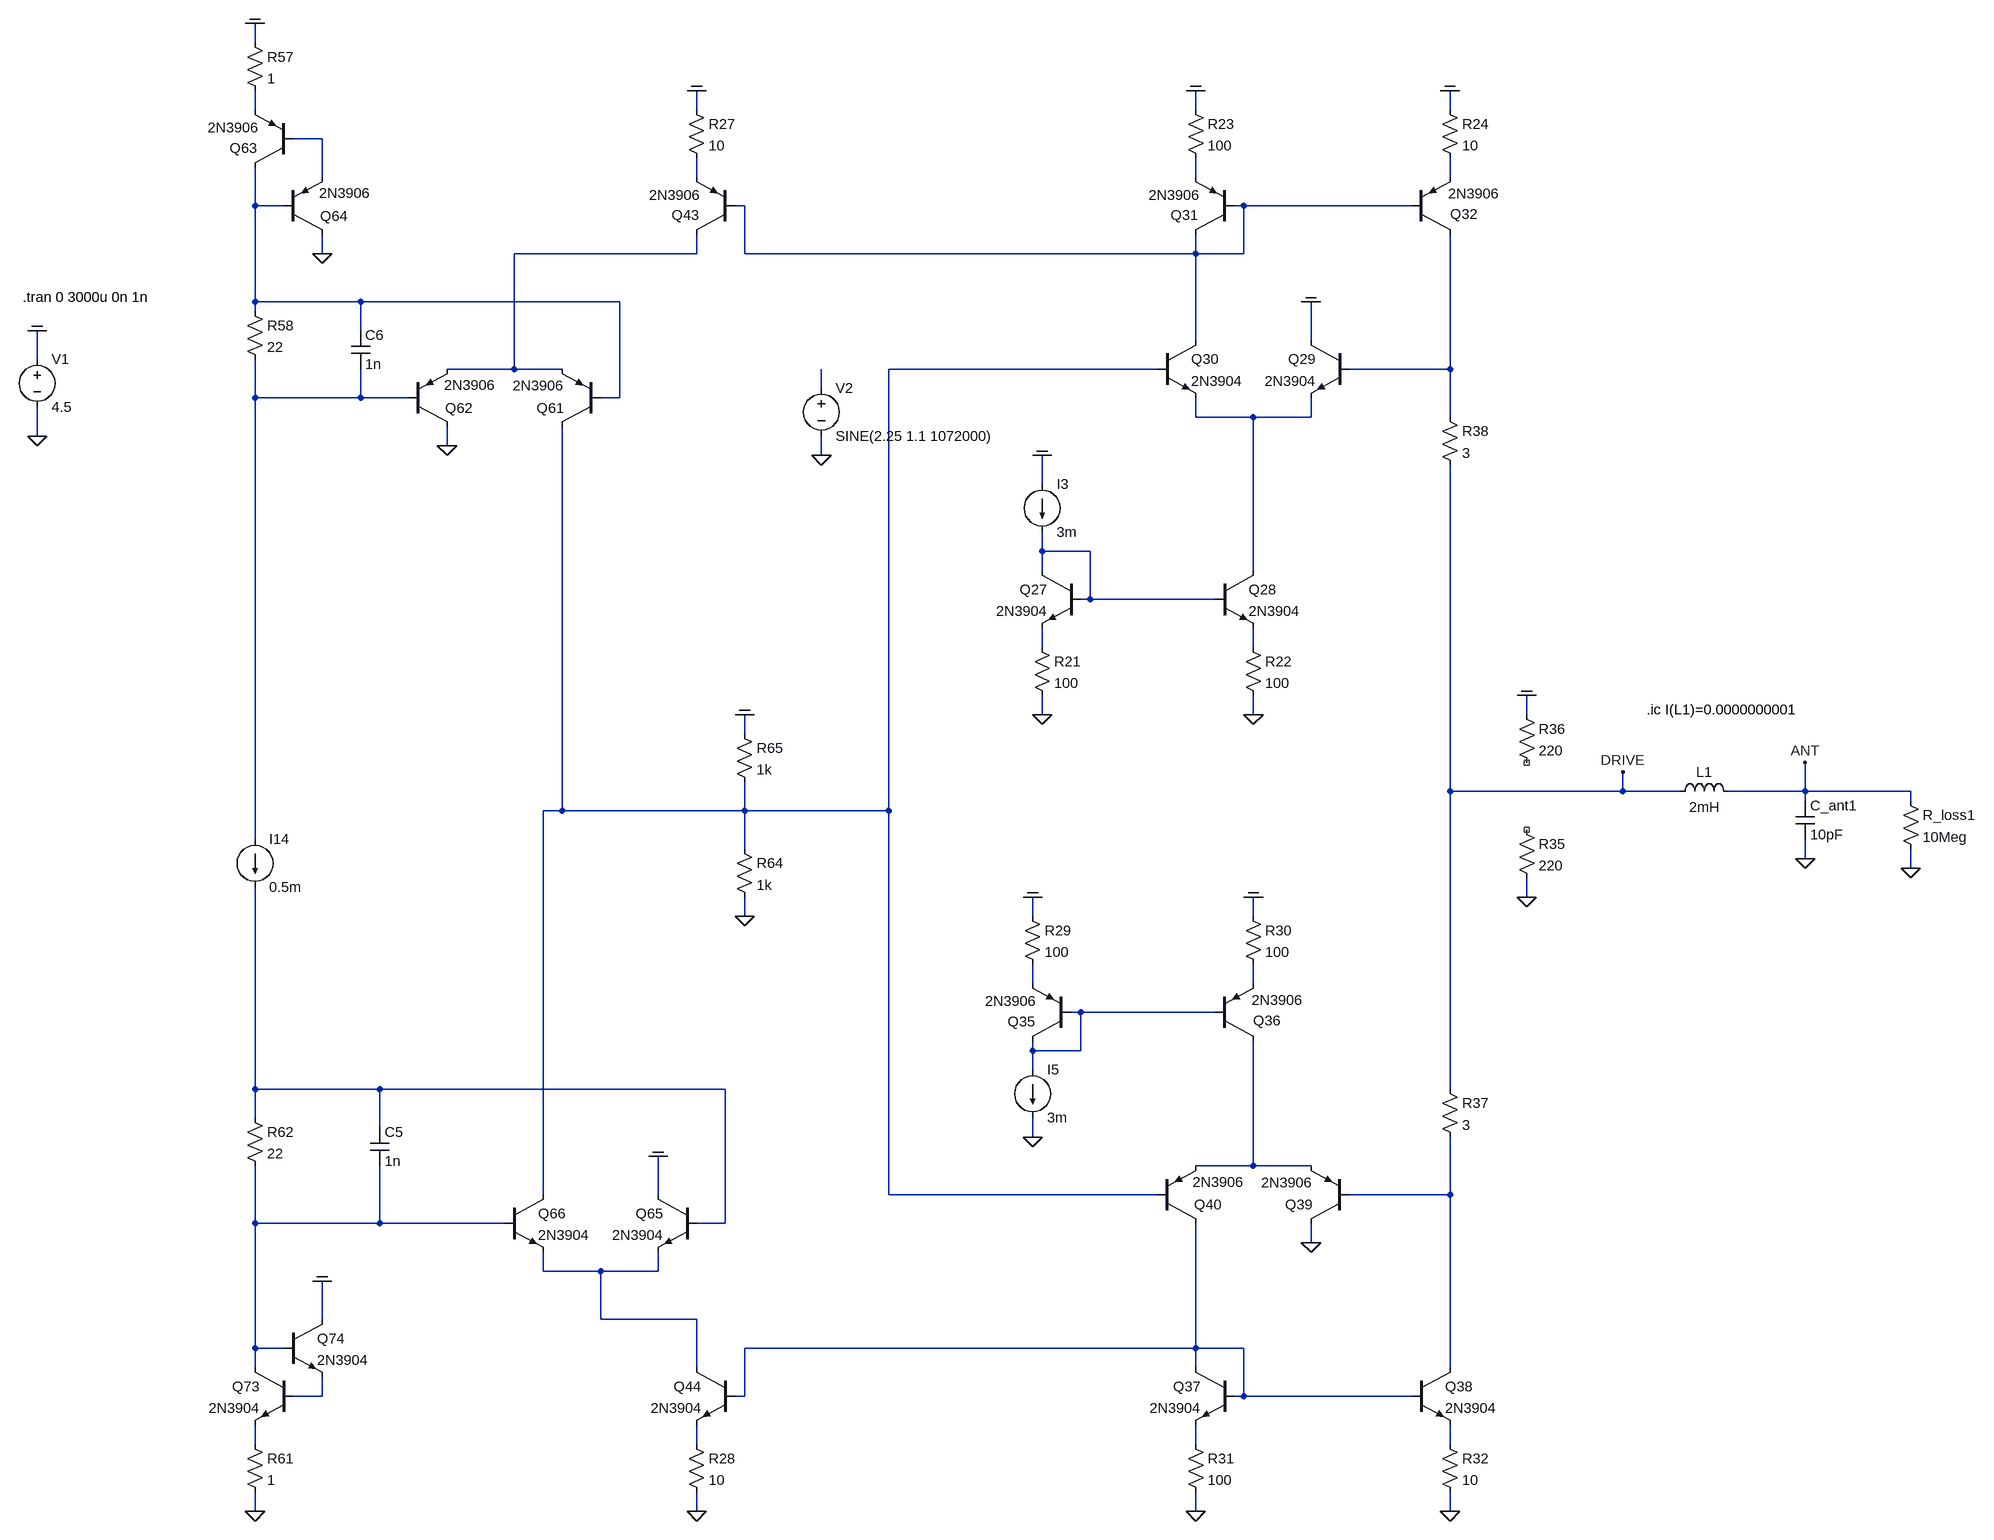
[diagram p0: schematic current_sensing_drive_buffer_v01.asc]
current_sensing_drive_buffer_v01.asc, the LTspice schematic file:
Version 4
SHEET 1 4504 6144
WIRE -320 1792 -320 1760
WIRE -320 1904 -320 1872
WIRE 416 1904 416 1872
WIRE 1248 1904 1248 1872
WIRE 1760 1904 1760 1872
WIRE -208 1952 -256 1952
WIRE -208 2016 -208 1952
WIRE 416 2016 416 1984
WIRE 1248 2016 1248 1984
WIRE 1760 2016 1760 1984
WIRE -320 2064 -320 2000
WIRE -272 2064 -320 2064
WIRE 496 2064 480 2064
WIRE 1328 2064 1312 2064
WIRE 1696 2064 1328 2064
WIRE -208 2144 -208 2112
WIRE 416 2144 416 2112
WIRE 416 2144 112 2144
WIRE 496 2144 496 2064
WIRE 1248 2144 1248 2112
WIRE 1248 2144 496 2144
WIRE 1328 2144 1328 2064
WIRE 1328 2144 1248 2144
WIRE -320 2224 -320 2064
WIRE -144 2224 -320 2224
WIRE 288 2224 -144 2224
WIRE -320 2240 -320 2224
WIRE -144 2272 -144 2224
WIRE 1248 2288 1248 2144
WIRE 1440 2288 1440 2224
WIRE -848 2320 -848 2272
WIRE 112 2336 112 2144
WIRE 112 2336 0 2336
WIRE 192 2336 112 2336
WIRE 1184 2336 736 2336
WIRE 1760 2336 1760 2112
WIRE 1760 2336 1504 2336
WIRE 624 2368 624 2336
WIRE -320 2384 -320 2320
WIRE -144 2384 -144 2336
WIRE -144 2384 -320 2384
WIRE -64 2384 -144 2384
WIRE 288 2384 288 2224
WIRE 288 2384 256 2384
WIRE 1248 2416 1248 2384
WIRE 1344 2416 1248 2416
WIRE 1440 2416 1440 2384
WIRE 1440 2416 1344 2416
WIRE 1760 2416 1760 2336
WIRE -848 2448 -848 2400
WIRE 0 2464 0 2432
WIRE 624 2480 624 2448
WIRE 992 2528 992 2480
WIRE 992 2640 992 2608
WIRE 1072 2640 992 2640
WIRE 992 2672 992 2640
WIRE 1344 2672 1344 2416
WIRE 1072 2720 1072 2640
WIRE 1072 2720 1056 2720
WIRE 1280 2720 1072 2720
WIRE 992 2800 992 2768
WIRE 1344 2800 1344 2768
WIRE 992 2912 992 2880
WIRE 1344 2912 1344 2880
WIRE 1888 2912 1888 2880
WIRE 496 2944 496 2912
WIRE 1760 3040 1760 2496
WIRE 2048 3040 2048 3008
WIRE 2048 3040 1760 3040
WIRE 2144 3040 2048 3040
WIRE 2352 3040 2352 2992
WIRE 2352 3040 2224 3040
WIRE 2528 3040 2352 3040
WIRE 2352 3056 2352 3040
WIRE 2528 3056 2528 3040
WIRE 192 3072 192 2432
WIRE 192 3072 160 3072
WIRE 496 3072 496 3024
WIRE 496 3072 192 3072
WIRE 736 3072 736 2336
WIRE 736 3072 496 3072
WIRE -320 3120 -320 2384
WIRE 496 3136 496 3072
WIRE 2352 3152 2352 3120
WIRE 2528 3168 2528 3136
WIRE 1888 3216 1888 3184
WIRE 496 3248 496 3216
WIRE 976 3248 976 3216
WIRE 1344 3248 1344 3216
WIRE 976 3360 976 3328
WIRE 1344 3360 1344 3328
WIRE 1056 3408 1040 3408
WIRE 1280 3408 1056 3408
WIRE 976 3472 976 3456
WIRE 1056 3472 1056 3408
WIRE 1056 3472 976 3472
WIRE 976 3504 976 3472
WIRE -320 3536 -320 3200
WIRE -112 3536 -320 3536
WIRE 464 3536 -112 3536
WIRE 1760 3536 1760 3040
WIRE -320 3584 -320 3536
WIRE -112 3600 -112 3536
WIRE 976 3616 976 3584
WIRE 1344 3664 1344 3456
WIRE 1344 3664 1248 3664
WIRE 1440 3664 1344 3664
WIRE 160 3712 160 3072
WIRE 352 3712 352 3648
WIRE 736 3712 736 3072
WIRE 1184 3712 736 3712
WIRE 1760 3712 1760 3616
WIRE 1760 3712 1504 3712
WIRE -320 3760 -320 3664
WIRE -112 3760 -112 3664
WIRE -112 3760 -320 3760
WIRE 96 3760 -112 3760
WIRE 464 3760 464 3536
WIRE 464 3760 416 3760
WIRE 1440 3792 1440 3760
WIRE 160 3840 160 3808
WIRE 256 3840 160 3840
WIRE 352 3840 352 3808
WIRE 352 3840 256 3840
WIRE -208 3920 -208 3856
WIRE 256 3920 256 3840
WIRE 416 3920 256 3920
WIRE -320 3968 -320 3760
WIRE -272 3968 -320 3968
WIRE 1248 3968 1248 3760
WIRE 1248 3968 496 3968
WIRE 1328 3968 1248 3968
WIRE -320 4000 -320 3968
WIRE 416 4000 416 3920
WIRE 1248 4000 1248 3968
WIRE 1760 4000 1760 3712
WIRE -208 4048 -208 4016
WIRE -208 4048 -256 4048
WIRE 496 4048 496 3968
WIRE 496 4048 480 4048
WIRE 1328 4048 1328 3968
WIRE 1328 4048 1312 4048
WIRE 1696 4048 1328 4048
WIRE -320 4128 -320 4096
WIRE 416 4128 416 4096
WIRE 1248 4128 1248 4096
WIRE 1760 4128 1760 4096
WIRE -320 4240 -320 4208
WIRE 416 4240 416 4208
WIRE 1248 4240 1248 4208
WIRE 1760 4240 1760 4208
FLAG -848 2448 0
FLAG -848 2272 COM
FLAG 992 2912 0
FLAG 1344 2912 0
FLAG 992 2480 COM
FLAG 1248 1872 COM
FLAG 1760 1872 COM
FLAG 1440 2224 COM
FLAG 624 2480 0
FLAG 976 3216 COM
FLAG 1344 3216 COM
FLAG 976 3616 0
FLAG 1248 4240 0
FLAG 1760 4240 0
FLAG 1440 3792 0
FLAG 416 1872 COM
FLAG 416 4240 0
FLAG 1888 3216 0
FLAG 1888 2880 COM
FLAG 2352 3152 0
FLAG 2352 2992 ANT
FLAG 2048 3008 DRIVE
FLAG 2528 3168 0
FLAG 496 3248 0
FLAG 496 2912 COM
FLAG -320 1760 COM
FLAG 0 2464 0
FLAG 352 3648 COM
FLAG -320 4240 0
FLAG -208 2144 0
FLAG -208 3856 COM
SYMBOL voltage -848 2304 R0
SYMATTR InstName V1
SYMATTR Value 4.5
SYMBOL npn 1056 2672 M0
SYMATTR InstName Q27
SYMATTR Value 2N3904
SYMBOL npn 1280 2672 R0
SYMATTR InstName Q28
SYMATTR Value 2N3904
SYMBOL Res 976 2784 R0
SYMATTR InstName R21
SYMATTR Value 100
SYMBOL Res 1328 2784 R0
SYMATTR InstName R22
SYMATTR Value 100
SYMBOL current 992 2528 R0
SYMATTR InstName I3
SYMATTR Value 3m
SYMBOL npn 1504 2288 M0
SYMATTR InstName Q29
SYMATTR Value 2N3904
SYMBOL npn 1184 2288 R0
SYMATTR InstName Q30
SYMATTR Value 2N3904
SYMBOL pnp 1312 2112 R180
WINDOW 0 60 32 Left 2
WINDOW 3 58 66 Left 2
SYMATTR InstName Q31
SYMATTR Value 2N3906
SYMBOL Res 1232 1888 R0
SYMATTR InstName R23
SYMATTR Value 100
SYMBOL pnp 1696 2112 M180
WINDOW 0 64 34 Left 2
WINDOW 3 61 68 Left 2
SYMATTR InstName Q32
SYMATTR Value 2N3906
SYMBOL Res 1744 1888 R0
SYMATTR InstName R24
SYMATTR Value 10
SYMBOL Voltage 624 2352 R0
SYMATTR InstName V2
SYMATTR Value SINE(2.25 1.1 1072000)
SYMBOL pnp 1040 3456 R180
WINDOW 0 60 32 Left 2
WINDOW 3 58 66 Left 2
SYMATTR InstName Q35
SYMATTR Value 2N3906
SYMBOL Res 960 3232 R0
SYMATTR InstName R29
SYMATTR Value 100
SYMBOL pnp 1280 3456 M180
WINDOW 0 64 34 Left 2
WINDOW 3 61 68 Left 2
SYMATTR InstName Q36
SYMATTR Value 2N3906
SYMBOL Res 1328 3232 R0
SYMATTR InstName R30
SYMATTR Value 100
SYMBOL current 976 3504 R0
SYMATTR InstName I5
SYMATTR Value 3m
SYMBOL npn 1312 4000 M0
SYMATTR InstName Q37
SYMATTR Value 2N3904
SYMBOL npn 1696 4000 R0
SYMATTR InstName Q38
SYMATTR Value 2N3904
SYMBOL Res 1232 4112 R0
SYMATTR InstName R31
SYMATTR Value 100
SYMBOL Res 1744 4112 R0
SYMATTR InstName R32
SYMATTR Value 10
SYMBOL pnp 1504 3760 R180
WINDOW 0 61 31 Left 2
WINDOW 3 62 68 Left 2
SYMATTR InstName Q39
SYMATTR Value 2N3906
SYMBOL pnp 1184 3760 M180
WINDOW 0 61 31 Left 2
WINDOW 3 59 69 Left 2
SYMATTR InstName Q40
SYMATTR Value 2N3906
SYMBOL Res 1744 3520 R0
SYMATTR InstName R37
SYMATTR Value 3
SYMBOL Res 1744 2400 R0
SYMATTR InstName R38
SYMATTR Value 3
SYMBOL pnp 480 2112 R180
WINDOW 0 60 32 Left 2
WINDOW 3 58 66 Left 2
SYMATTR InstName Q43
SYMATTR Value 2N3906
SYMBOL Res 400 1888 R0
SYMATTR InstName R27
SYMATTR Value 10
SYMBOL npn 480 4000 M0
SYMATTR InstName Q44
SYMATTR Value 2N3904
SYMBOL Res 400 4112 R0
SYMATTR InstName R28
SYMATTR Value 10
SYMBOL Res 1872 3088 R0
SYMATTR InstName R35
SYMATTR Value 220
SYMBOL Res 1872 2896 R0
SYMATTR InstName R36
SYMATTR Value 220
SYMBOL ind 2128 3056 R270
WINDOW 0 32 56 VTop 2
WINDOW 3 5 56 VBottom 2
SYMATTR InstName L1
SYMATTR Value 2mH
SYMATTR SpiceLine Rser=120 Cpar=1pF
SYMBOL Cap 2336 3056 R0
SYMATTR InstName C_ant1
SYMATTR Value 10pF
SYMBOL Res 2512 3040 R0
SYMATTR InstName R_loss1
SYMATTR Value 10Meg
SYMBOL Res 480 3120 R0
SYMATTR InstName R64
SYMATTR Value 1k
SYMBOL Res 480 2928 R0
SYMATTR InstName R65
SYMATTR Value 1k
SYMBOL pnp 256 2432 R180
WINDOW 0 61 31 Left 2
WINDOW 3 62 68 Left 2
SYMATTR InstName Q61
SYMATTR Value 2N3906
SYMBOL pnp -64 2432 M180
WINDOW 0 61 31 Left 2
WINDOW 3 59 69 Left 2
SYMATTR InstName Q62
SYMATTR Value 2N3906
SYMBOL pnp -256 2000 R180
WINDOW 0 60 32 Left 2
WINDOW 3 58 66 Left 2
SYMATTR InstName Q63
SYMATTR Value 2N3906
SYMBOL Res -336 1776 R0
SYMATTR InstName R57
SYMATTR Value 1
SYMBOL Res -336 2224 R0
SYMATTR InstName R58
SYMATTR Value 22
SYMBOL npn 416 3712 M0
SYMATTR InstName Q65
SYMATTR Value 2N3904
SYMBOL npn 96 3712 R0
SYMATTR InstName Q66
SYMATTR Value 2N3904
SYMBOL npn -256 4000 M0
SYMATTR InstName Q73
SYMATTR Value 2N3904
SYMBOL Res -336 4112 R0
SYMATTR InstName R61
SYMATTR Value 1
SYMBOL Res -336 3568 R0
SYMATTR InstName R62
SYMATTR Value 22
SYMBOL pnp -272 2112 M180
WINDOW 0 61 31 Left 2
WINDOW 3 59 69 Left 2
SYMATTR InstName Q64
SYMATTR Value 2N3906
SYMBOL npn -272 3920 R0
SYMATTR InstName Q74
SYMATTR Value 2N3904
SYMBOL current -320 3120 R0
SYMATTR InstName I14
SYMATTR Value 0.5m
SYMBOL Cap -128 3600 R0
SYMATTR InstName C5
SYMATTR Value 1n
SYMBOL Cap -160 2272 R0
SYMATTR InstName C6
SYMATTR Value 1n
TEXT -872 2216 Left 2 !.tran 0 3000u 0n 1n
TEXT 2088 2904 Left 2 !.ic I(L1)=0.0000000001

The netlist it stands for:
* current_sensing_drive_buffer_v01.asc
V1 COM 0 4.5
Q27 N014 N014 N015 0 2N3904
Q28 N013 N014 N016 0 2N3904
R21 N015 0 100
R22 N016 0 100
I3 COM N014 3m
Q29 COM N010 N013 0 2N3904
Q30 N007 N009 N013 0 2N3904
Q31 N007 N007 N004 0 2N3906
R23 COM N004 100
Q32 N010 N007 N005 0 2N3906
R24 COM N005 10
V2 N011 0 SINE(2.25 1.1 1072000)
Q35 N019 N019 N017 0 2N3906
R29 COM N017 100
Q36 N021 N019 N018 0 2N3906
R30 COM N018 100
I5 N019 0 3m
Q37 N025 N025 N029 0 2N3904
Q38 N022 N025 N030 0 2N3904
R31 N029 0 100
R32 N030 0 10
Q39 0 N022 N021 0 2N3906
Q40 N025 N009 N021 0 2N3906
R37 DRIVE N022 3
R38 N010 DRIVE 3
Q43 N008 N007 N003 0 2N3906
R27 COM N003 10
Q44 N024 N025 N028 0 2N3904
R28 N028 0 10
R35 NC_01 0 220
R36 COM NC_02 220
L1 DRIVE ANT 2mH Rser=120 Cpar=1pF
C_ant1 ANT 0 10pF
R_loss1 ANT 0 10Meg
R64 N009 0 1k
R65 COM N009 1k
Q61 N009 N006 N008 0 2N3906
Q62 0 N012 N008 0 2N3906
Q63 N006 N002 N001 0 2N3906
R57 COM N001 1
R58 N006 N012 22
Q65 COM N020 N024 0 2N3904
Q66 N009 N023 N024 0 2N3904
Q73 N023 N026 N027 0 2N3904
R61 N027 0 1
R62 N020 N023 22
Q64 0 N006 N002 0 2N3906
Q74 COM N023 N026 0 2N3904
I14 N012 N020 0.5m
C5 N020 N023 1n
C6 N006 N012 1n
.model NPN NPN
.model PNP PNP
.lib standard.bjt
.tran 0 3000u 0n 1n
.ic I(L1)=0.0000000001
.backanno
.end